# EAGLE design batteryholder2S6P (EAGLE 9.5.0)
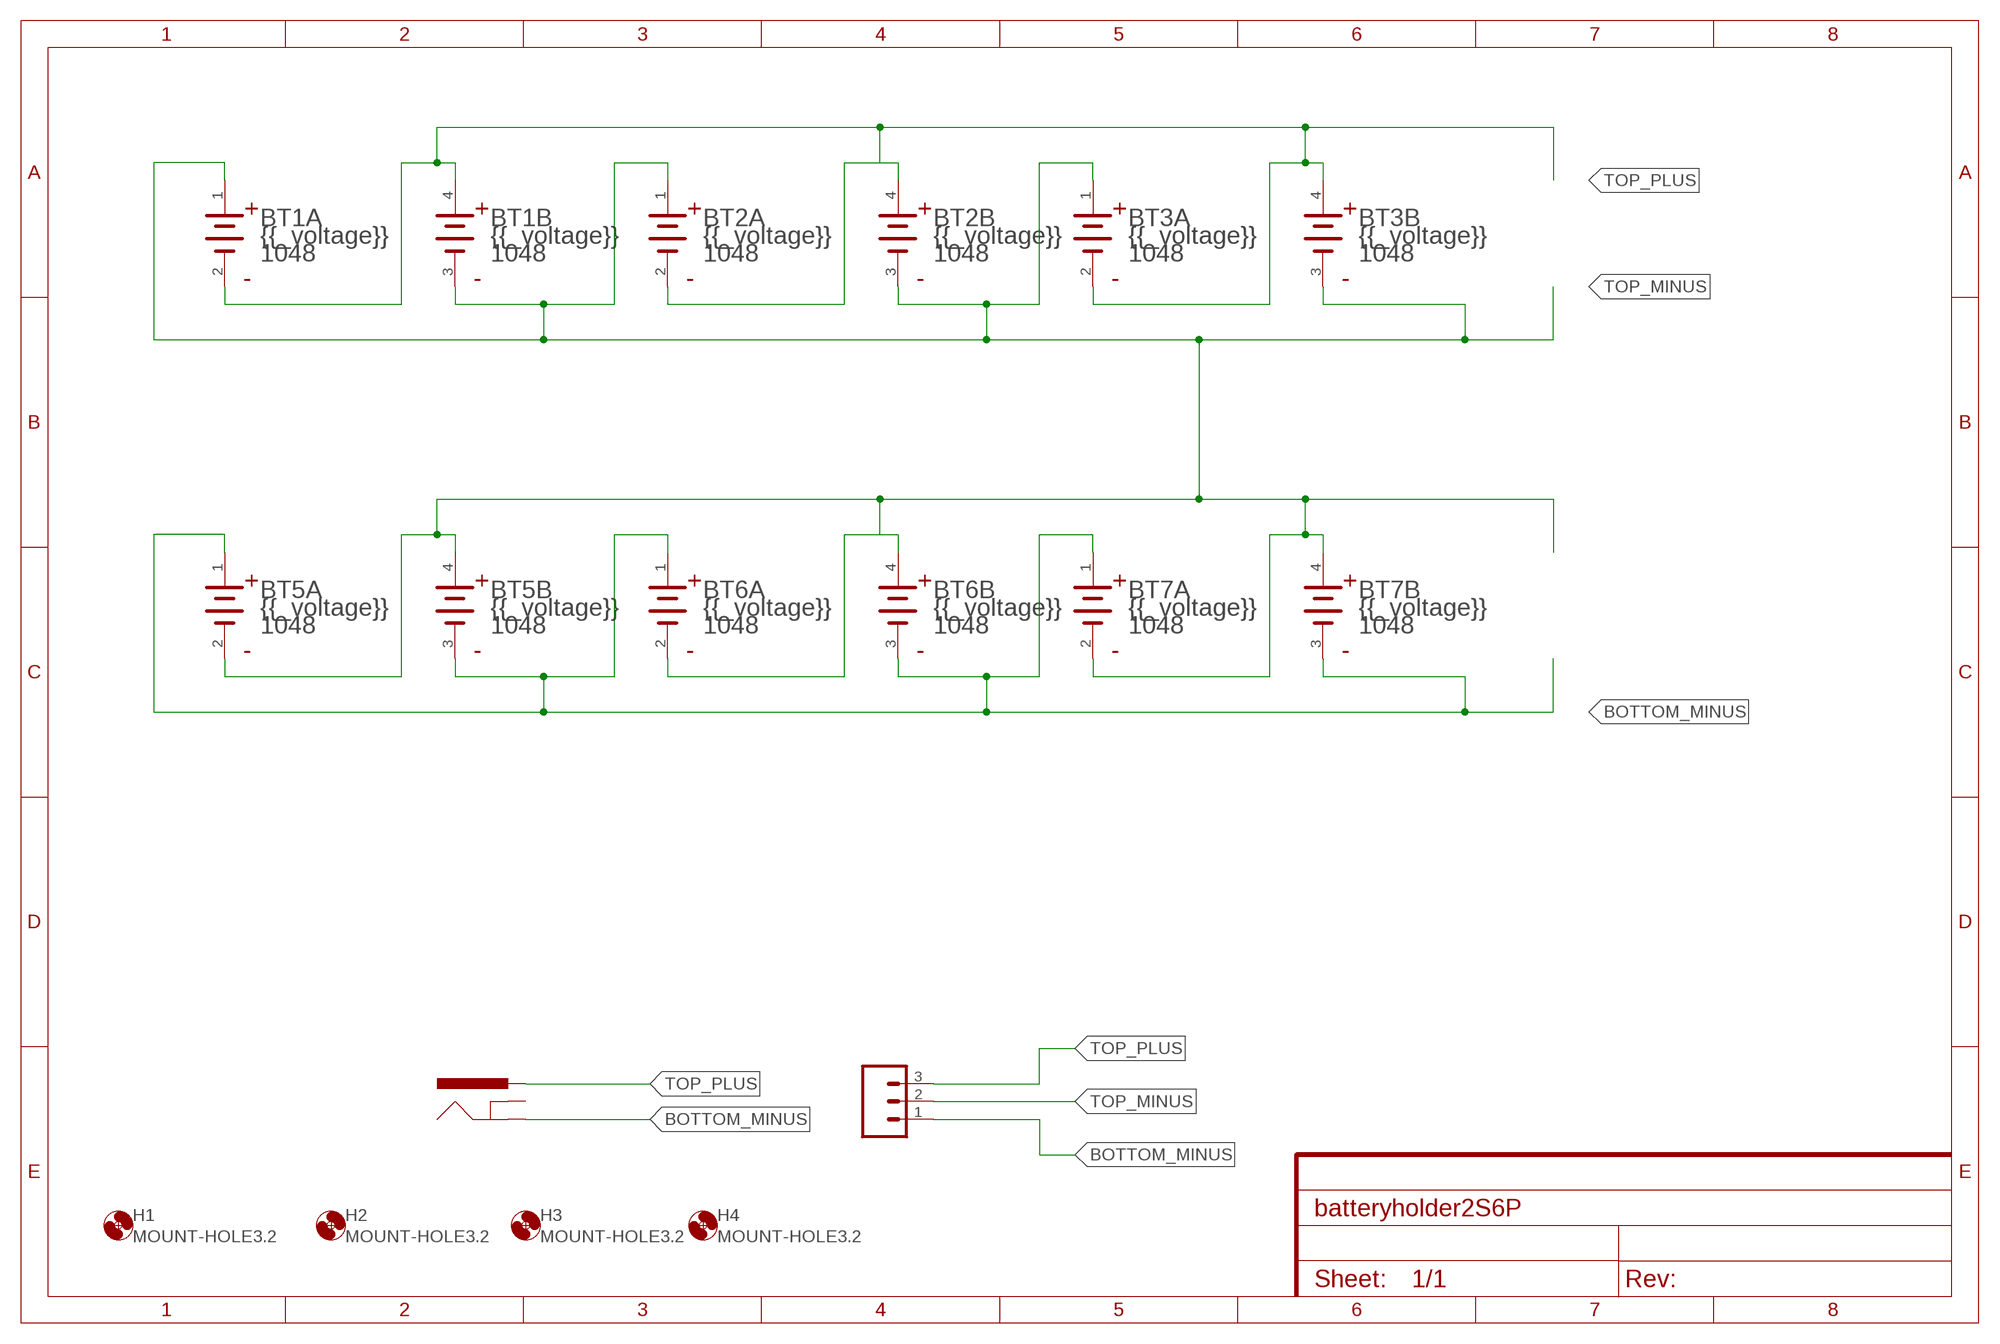
[diagram p0: schematic, sheet 1]

## Parts
BT1  KEYSTONE_1048KEYSTONE_1048_0_0  [KEYSTONE_1048_0]
BT2  KEYSTONE_1048KEYSTONE_1048_0_0  [KEYSTONE_1048_0]
BT3  KEYSTONE_1048KEYSTONE_1048_0_0  [KEYSTONE_1048_0]
BT5  KEYSTONE_1048KEYSTONE_1048_0_0  [KEYSTONE_1048_0]
BT6  KEYSTONE_1048KEYSTONE_1048_0_0  [KEYSTONE_1048_0]
BT7  KEYSTONE_1048KEYSTONE_1048_0_0  [KEYSTONE_1048_0]
H1  MOUNT-HOLE3.2  [3,2]
H2  MOUNT-HOLE3.2  [3,2]
H3  MOUNT-HOLE3.2  [3,2]
H4  MOUNT-HOLE3.2  [3,2]
J1  CONN_03-SCREW-5MM  [SCREWTERMINAL-5MM-3]
J3  POWER_JACKPTH_BREAD  [POWER_JACK_PTH_BREAD]

## Nets
BOTTOM_MINUS: BT5.1(A:1_ANODE) BT5.3(B:2_CATHODE) BT6.1(A:1_ANODE) BT6.3(B:2_CATHODE) BT7.1(A:1_ANODE) BT7.3(B:2_CATHODE) J1.1 J3.GND
TOP_MINUS: BT1.1(A:1_ANODE) BT1.3(B:2_CATHODE) BT2.1(A:1_ANODE) BT2.3(B:2_CATHODE) BT3.1(A:1_ANODE) BT3.3(B:2_CATHODE) BT5.2(A:1_CATHODE) BT5.4(B:2_ANODE) BT6.2(A:1_CATHODE) BT6.4(B:2_ANODE) BT7.2(A:1_CATHODE) BT7.4(B:2_ANODE) J1.2
TOP_PLUS: BT1.2(A:1_CATHODE) BT1.4(B:2_ANODE) BT2.2(A:1_CATHODE) BT2.4(B:2_ANODE) BT3.2(A:1_CATHODE) BT3.4(B:2_ANODE) J1.3 J3.PWR
Unconnected: J3.GNDBREAK

## Library data of the parts
BT1-BT3 BT5-BT7 = Keystone - 1048:KEYSTONE_1048: SMT Holder for Dual 18650 Batteries; CENTROID_NOT_SPECIFIED: No; CONN_ORIENTATION: Horizontal; CONTACT_MATERIAL: Gold,Nickel; DATASHEET: https://www.keyelco.com/userAssets/file/M65p27.pdf; DEVICE_CLASS_L1: Connectors; DEVICE_CLASS_L2: unset; DEVICE_CLASS_L3: unset; DIGIKEY_DESCRIPTION: BATT HOLDER 18650 2 CELL SMD TAB; DIGIKEY_PART_NUMBER: 36-1048-ND; FOOTPRINT_URL: https://www.keyelco.com/product-pdf.cfm?p=920; HEIGHT: 0.595inch; LEAD_FREE: yes; MF: Keystone; MFG_PACKAGE_IDENT: 1048; MFG_PACKAGE_IDENT_DATE: 0; MFG_PACKAGE_IDENT_REV: 0; MOUSER_DESCRIPTION: Battery holder SMD Dimensions L x W x H: 86 x 39.78 x 14.86 mm Suitable for: 2 x 18650; MOUSER_PART_NUMBER: 534-1048; MPN: 1048; NUMBER_OF_CONTACTS: 2; PACKAGE: SMT_BTTHLDR_18650_DUAL; PREFIX: BT; ROHS: yes; TEMPERATURE_RANGE_HIGH: +145°C; TEMPERATURE_RANGE_LOW: -50°C; VERIFICATION_VERSION: 0.0.0.1
H1-H4 = holes:MOUNT-HOLE: MOUNTING HOLE with drill center marker
J1 = SparkFun-Connectors:CONN_03: Multi connection point. Often used as Generic Header-pin footprint for 0.1 inch spaced/style header connections On any of the 0.1 inch spaced packages, you can populate with these: Break Away Headers - Straight <https://www.sparkfun.com/products/116> (PRT-00116) Break Away Male Headers - Right Angle <https://www.sparkfun.com/products/553> (PRT-00553) Female Headers <https://www.sparkfun.com/products/115> (PRT-00115) Break Away Headers - Machine Pin <https://www.sparkfun.com/products/117> (PRT-00117) Break Away Female Headers - Swiss Machine Pin <https://www.sparkfun.com/products/743> (PRT-00743) Stackable Header - 3 Pin (Female, 0.1") <https://www.sparkfun.com/products/13875> (PRT-13875) For SCREWTERMINALS and SPRING TERMINALS visit here: Screw Terimnals on SparkFun.com <https://www.sparkfun.com/search/results?term=Screw+Terminals> (5mm/3.5mm/2.54mm spacing) This device is also useful as a general connection point to wire up your design to another part of your project. Our various solder wires solder well into these plated through hole pads. Hook-Up Wire - Assortment (Stranded, 22 AWG) <https://www.sparkfun.com/products/11375> (PRT-11375) Hook-Up Wire - Assortment (Solid Core, 22 AWG) <https://www.sparkfun.com/products/11367> (PRT-11367) View the entire wire category on our website here <https://www.sparkfun.com/categories/141> Special notes: Molex polarized connector foot print use with SKU : PRT-08232 with associated crimp pins and housings.; PROD_ID: CONN-10134; SF_SKU: PRT-08433
J3 = SparkFun-Connectors:POWER_JACK: Power Jack Connector This is the standard 5.5mm barrel jack for power. The PTH is the most common, proven, reliable, footprint. The Slot footprint only works if the mill layer is transmitted to the PCB fab house so be warned. Here are the connectors we sell at SparkFun: DC Barrel Power Jack/Connector <https://www.sparkfun.com/products/119> (PRT-00119) DC Barrel Power Jack/Connector (SMD) <https://www.sparkfun.com/products/12748> (PRT-12748) DC Barrel Jack Adapter - Breadboard Compatible <https://www.sparkfun.com/products/10811> (PRT-10811) It is used on this SparkFun product (and many, many others): SparkFun RedBoard - Programmed with Arduino <https://www.sparkfun.com/products/12757> (DEV-12757) Also, if you need a mating power supply or connector, please check these out: Wall Adapter Power Supply - 9VDC 650mA <https://www.sparkfun.com/products/298> (TOL-00298) DC Barrel Jack Adapter - Male <https://www.sparkfun.com/products/10287> (PRT-10287); PROD_ID: PRT-10811

## Board
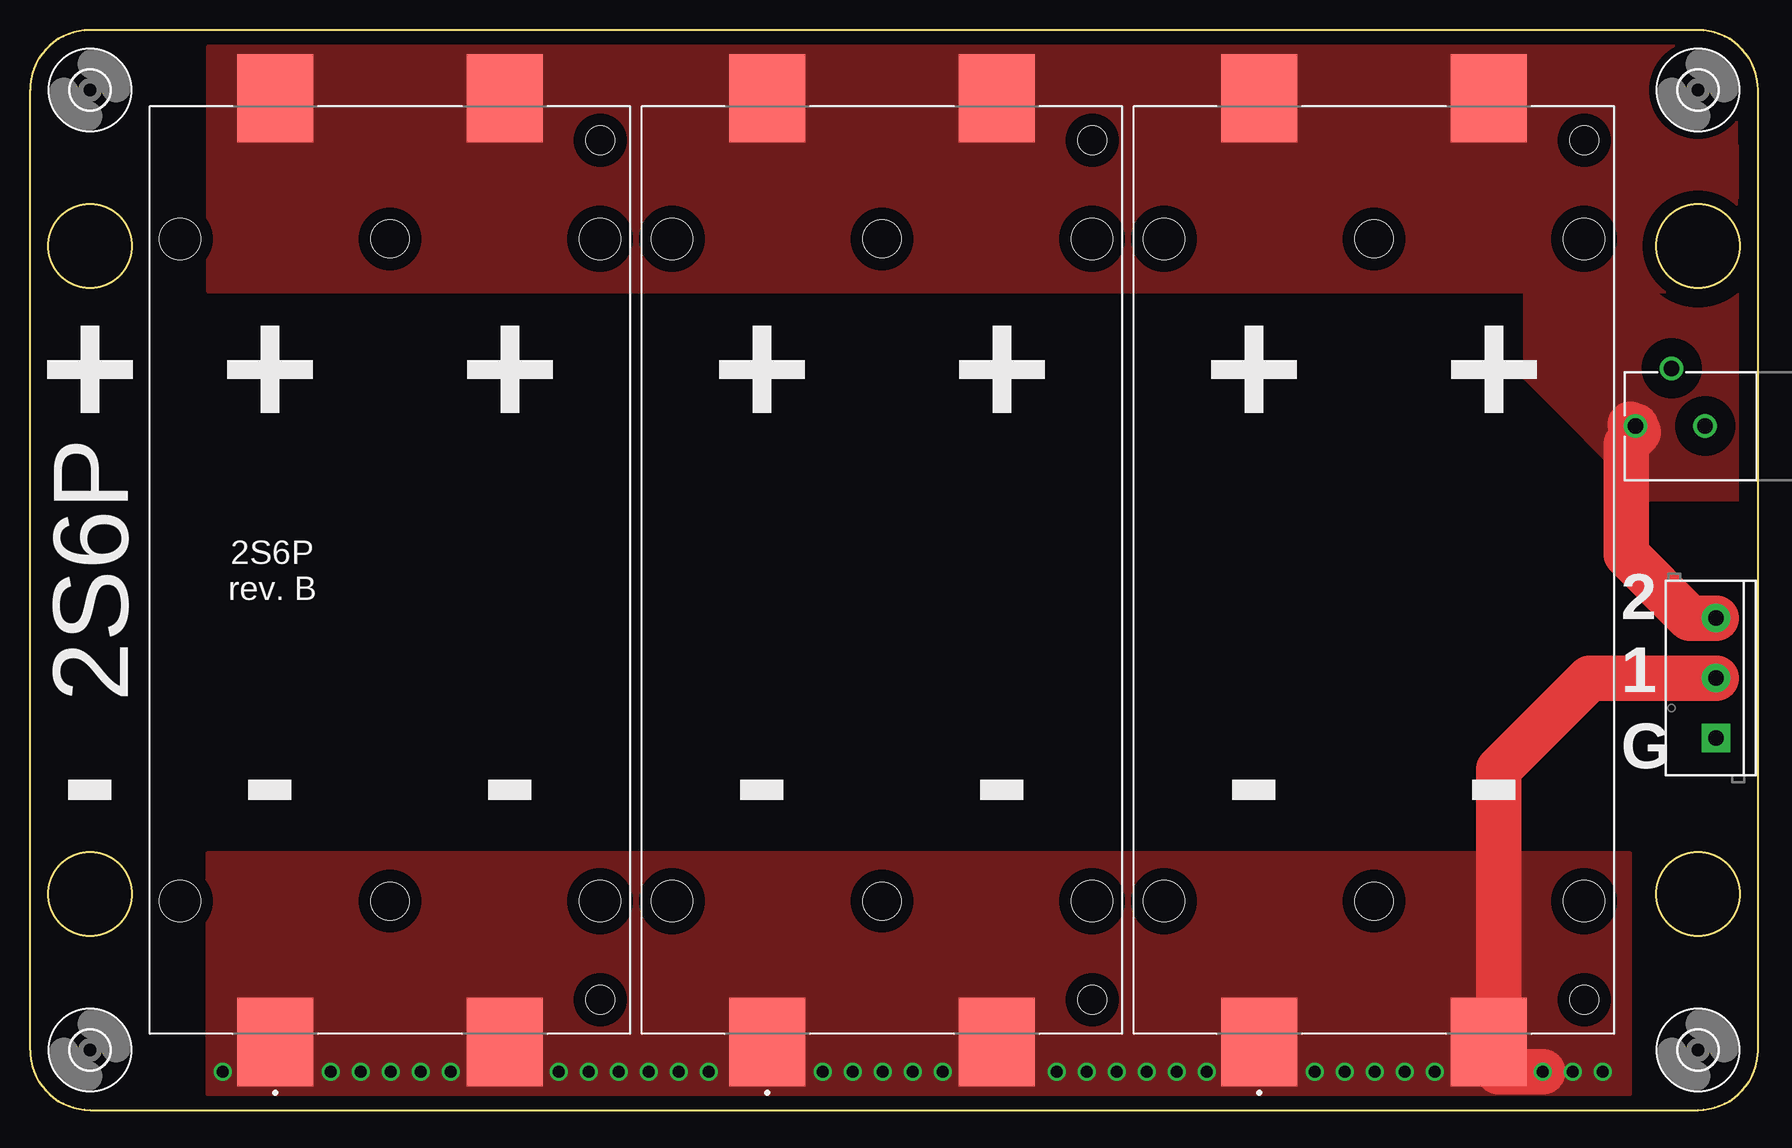
[diagram p1: board, top side]
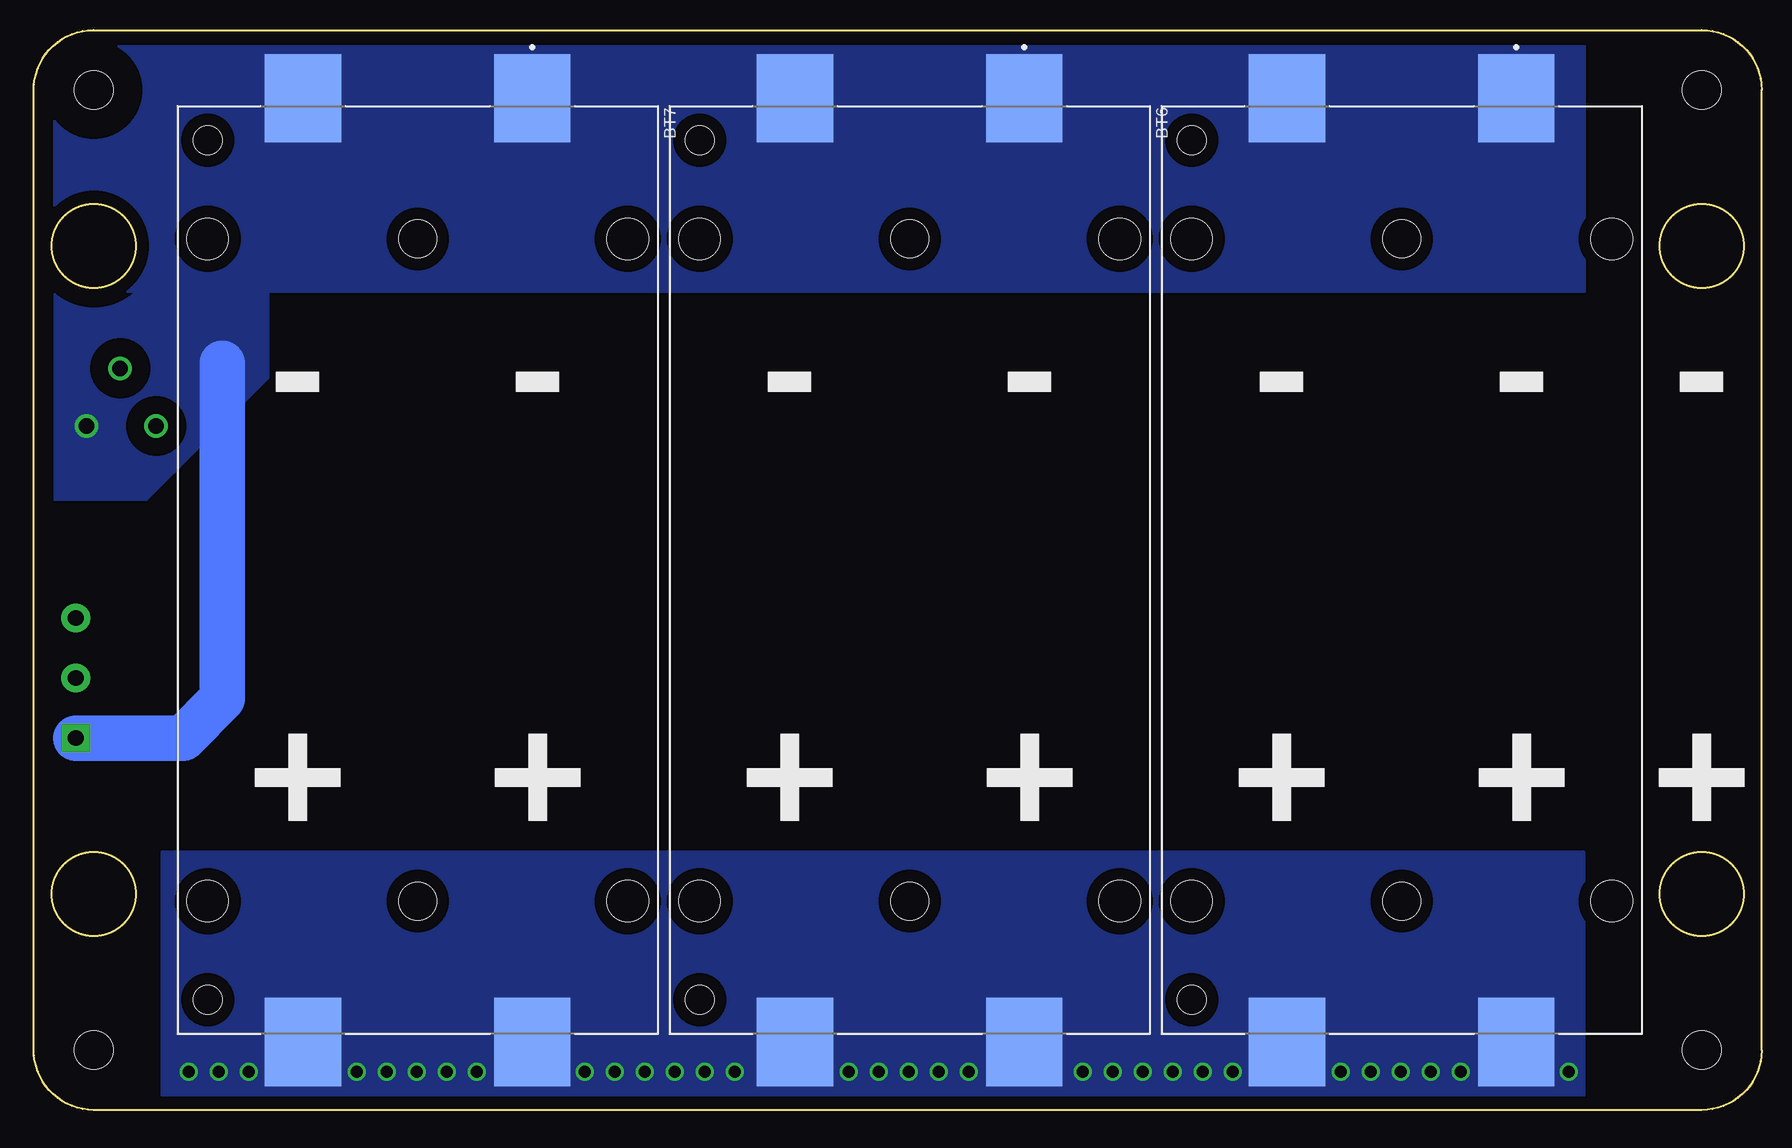
[diagram p2: board, bottom side, seen from below]

Size 144 x 90 mm. Coordinates in mm from the lower left corner, seen from the top.
Outline: 0,76.1 0,5 arc90 5,0 139,0 arc90 144,5 144,85 arc90 139,90 5,90 arc90 0,85 0,76
Outline: circle at 5,18 radius 3.5
Outline: circle at 5,72 radius 3.5
Outline: circle at 139,72 radius 3.5
Outline: circle at 139,18 radius 3.5
Copper layers (1*16): Top 0.035mm / dielectric 1.5mm / Bottom 0.035mm
Design rules "default": minimum track width 6mil, minimum drill 0.35mm, track to track 6mil, track to pad 6mil, pad to pad 6mil, via to via 6mil, smd to smd 6mil, copper to edge 40mil, drill to drill 6mil, minimum pad ring 10mil, minimum via ring 8mil, stop-mask expansion 4mil, vias tented up to drill 0mil, thermal gap 10mil

### Footprints (pad centres in the part's own frame; a part is rotated, then mirrored left to right if it is on the bottom)
KEYSTONE_1048_0 = smd 7.34 x 6.35: 1 -39.33,9.555; 2 39.33,9.555; 3 -39.33,-9.555; 4 39.33,-9.555 | hole 3.45: 27.6,17.505; -27.6,-17.505 | hole 2.39: 35.82,-17.505 | hole 3.17: 27.6,0; -27.6,0
3,2 = hole 3.2: 0,0
SCREWTERMINAL-5MM-3 = drill 1.3 pad 2.413 square: 1 0,0 | drill 1.3 pad 2.413: 2 5,0; 3 10,0
POWER_JACK_PTH_BREAD = drill 1.3: GND 0,7.9; GNDBREAK 4.8,10.7; PWR 0,13.7

### Placement (x,y rotation side)
BT1  30,45 90 top
BT2  71,45 90 top
BT3  112,45 90 top
BT5  30,45 270 bottom
BT6  71,45 270 bottom
BT7  112,45 270 bottom
H1  5,85 0 top
H2  5,5 0 top
H3  139,85 0 top
H4  139,5 0 top
J1  140.5,31 90 top
J3  147.5,57 90 top

### Tracks (layer width: path | path; a pad name or v marks a point on that pad's centre or on a via)
BOTTOM_MINUS
  Bottom 3.81: 128.27,62.23 128.27,34.29 131.56,31 J1.1
  pour Bottom (no thermals): 14.78,88.63 14.78,68.2 142.23,68.2 142.23,88.63
  pour Bottom (isolate 1.524, no thermals): 124.46,87.63 124.46,60.96 134.62,50.8 143.51,50.8 143.51,87.63
TOP_MINUS  (via drill 1)
  Top 3.81: J1.2 129.98,36 122.38,28.4 122.38,3.18 v126.07,3.18
  other vias: 131.07,3.18 128.57,3.18 117.07,3.18 114.57,3.18 112.07,3.18 109.57,3.18 107.07,3.18 98.07,3.18 95.57,3.18 93.07,3.18 90.57,3.18 88.07,3.18 85.57,3.18 76.07,3.18 73.57,3.18 71.07,3.18 68.57,3.18 66.07,3.18 56.57,3.18 54.07,3.18 51.57,3.18 49.07,3.18 46.57,3.18 44.07,3.18 35.07,3.18 32.57,3.18 30.07,3.18 27.57,3.18 25.07,3.18 16.07,3.18
  pour Top (no thermals): 14.78,1.27 14.78,21.47 133.35,21.47 133.35,1.27
  pour Bottom (no thermals): 14.78,1.27 14.78,21.47 133.35,21.47 133.35,1.27
TOP_PLUS
  Top 3.81: J3.PWR 133.35,57.15 134,56.5 133,55.5 133,46.3 138.3,41 J1.3
  pour Top (no thermals): 14.78,88.63 14.78,68.2 142.23,68.2 142.23,88.63
  pour Top (isolate 1.524): 124.46,87.63 124.46,60.96 134.62,50.8 143.51,50.8 143.51,87.63

### Text on the board
tPlace: + | + | + | + | + | + | + | 2S6P | 2S6P | rev. B | 2 | 1 | - | - | - | - | - | - | - | G
bPlace: - | - | - | - | - | - | - | + | + | + | + | + | + | +